# EasyEDA Pro project Arsatech-Vital-Tracker-PCB.epro

# Schematic Schematic1
Board Name: Board1; Create Date: 2025-01-30; Page Name: P1; Project Name: KPFIX; Schematic Name: Schematic1; Update Date: 2025-01-30; Company: EasyEDA.com; Page Size: A4; Version: V1.0
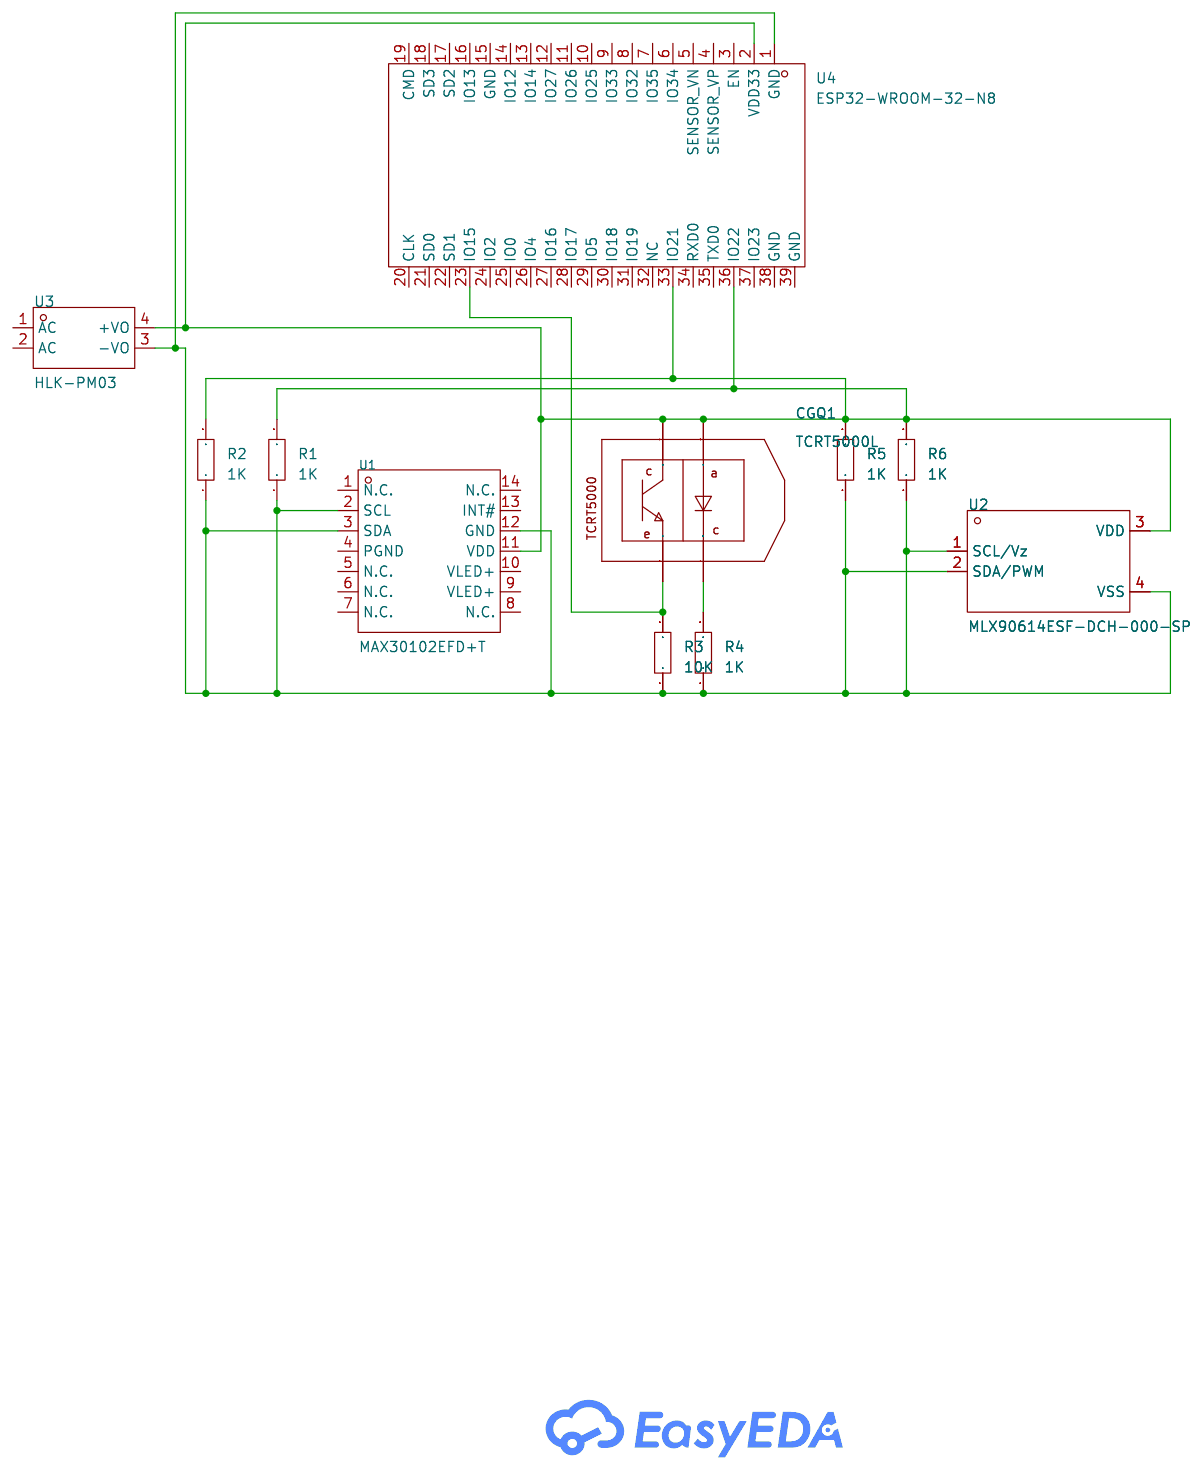
[diagram p0: schematic sheet]

## Parts
CGQ1  TCRT5000L  [OPTO-TH_TCRT5000L]
R1  1K  [R0603]
R2  1K  [R0603]
R3  10K  [R0603]
R4  1K  [R0603]
R5  1K  [R0603]
R6  1K  [R0603]
U1  MAX30102EFD+T  [OESIP-14_L5.6-W3.3-P0.80-TL]
U2  MLX90614ESF-DCH-000-SP  [TO-39-4_MELEXIS_MLX90614XXA]
U3  HLK-PM03  [PWRM-TH_HLK-PM03]
U4  ESP32-WROOM-32-N8  [WIFIM-SMD_39P-L25.5-W18.0-P1.27]

## Library data of the parts
CGQ1 = TCRT5000L: Supplier Part: C24085; Manufacturer: VISHAY(威世); Supplier Footprint: 插件; JLCPCB Part Class: Extended Part; Datasheet: https://atta.szlcsc.com/upload/public/pdf/source/20150821/1457707346389.pdf; Supplier: LCSC
R1-R6 = Res_0603: Supplier Footprint: 0603
U1 = MAX30102EFD+T_C6454833: Operating Temperature:-40℃~+85℃ Operating Temperature:-40℃~+85℃; Supplier Part: C6454833; Manufacturer: ADI(亚德诺)/MAXIM(美信); Supplier Footprint: OESIP-14; JLCPCB Part Class: Extended Part; Datasheet: https://atta.szlcsc.com/upload/public/pdf/source/20230523/5357A0E2EBB238F1082B332F3131EA1A.pdf; Supplier: LCSC; Operating Temperature: -40℃~+85℃
U2 = MLX90614ESF-DCH-000-SP: Resolution:- Resolution:- Supply Voltage:2.6V~3.6V Supply Voltage:2.6V~3.6V; Supplier Part: C17185303; Manufacturer: Melexis(比利时迈来芯); Supplier Footprint: TO-39; JLCPCB Part Class: Extended Part; Datasheet: https://atta.szlcsc.com/upload/public/pdf/source/231023/C17192539-0c521c61c9b67c34f193697436f9a827.pdf; Supplier: LCSC; Supply Voltage: 2.6V~3.6V
U3 = HLK-PM03: Conversion Type:AC-DC Input Voltage(DC):120V~350V Input Voltage(DC):120V~350V Output Voltage:3.3V Output Voltage:3.3V Output Power:3W Input Voltage(AC):90VAC~265VAC Input Voltage(AC):90VAC~265VAC Output Current (Max):1A Output Current (Max):1A Function:St; Supplier Part: C209904; Manufacturer: HI-LINK(海凌科); Supplier Footprint: 插件; JLCPCB Part Class: Extended Part; Datasheet: https://atta.szlcsc.com/upload/public/pdf/source/20231009/A2CB2EF6B3F7CFD4452AD83E39216571.pdf; Supplier: LCSC; Conversion Type: AC-DC; Input Voltage(DC): 120V~350V; Output Voltage: 3.3V; Output Power: 3W; Input Voltage(AC): 90VAC~265VAC; Output Current (Max): 1A; Function: Step-down type; Output Channel: 1; Insulated Voltage: 3kV@AC; Conversion Efficiency: 72%; Feature: Overcurrent Protection；Short-Circuit Protection
U4 = ESP32-WROOM-32-N8: LCSC Part Name: ESP32-WROOM-32-N8 停产; Supplier Part: C529582; Manufacturer: ESPRESSIF(乐鑫); Supplier Footprint: SMD,18x25.5mm; JLCPCB Part Class: Extended Part; Datasheet: https://atta.szlcsc.com/upload/public/pdf/source/20241030/CCB539BBE3BF966BF47741EF6F78A315.pdf; Supplier: LCSC

## Nets
$1N1083: CGQ1.4(C) R4.2
Net-(CGQ1-1): CGQ1.1(C) CGQ1.3(A) R1.2 R2.2 R5.2 R6.2 U1.11(VDD) U2.3(VDD) U3.4(+VO) U4.2(VDD33) U4.33(IO21) U4.36(IO22)
Net-(CGQ1-2): CGQ1.2(E) R3.2 U4.23(IO15)
Net-(R1-1): R1.1 R2.1 R3.1 R4.1 R5.1 R6.1 U1.2(SCL) U1.3(SDA) U1.12(GND) U2.1(SCL/Vz) U2.2(SDA/PWM) U2.4(VSS) U3.3(-VO) U4.1(GND)

Not connected (* = marked no-connect by the designer): U1 1(N.C.) 4(PGND) 5(N.C.) 6(N.C.) 7(N.C.) 8(N.C.) 9(VLED+) 10(VLED+) 13(INT#) 14(N.C.); U3 1(AC) 2(AC); U4 3(EN) 4(SENSOR_VP) 5(SENSOR_VN) 6(IO34) 7(IO35) 8(IO32) 9(IO33) 10(IO25) 11(IO26) 12(IO27) 13(IO14) 14(IO12) 15(GND) 16(IO13) 17(SD2) 18(SD3) 19(CMD) 20(CLK) 21(SD0) 22(SD1) 24(IO2) 25(IO0) 26(IO4) 27(IO16) 28(IO17) 29(IO5) 30(IO18) 31(IO19) 32(NC) 34(RXD0) 35(TXD0) 37(IO23) 38(GND) 39(GND)

# Board PCB1
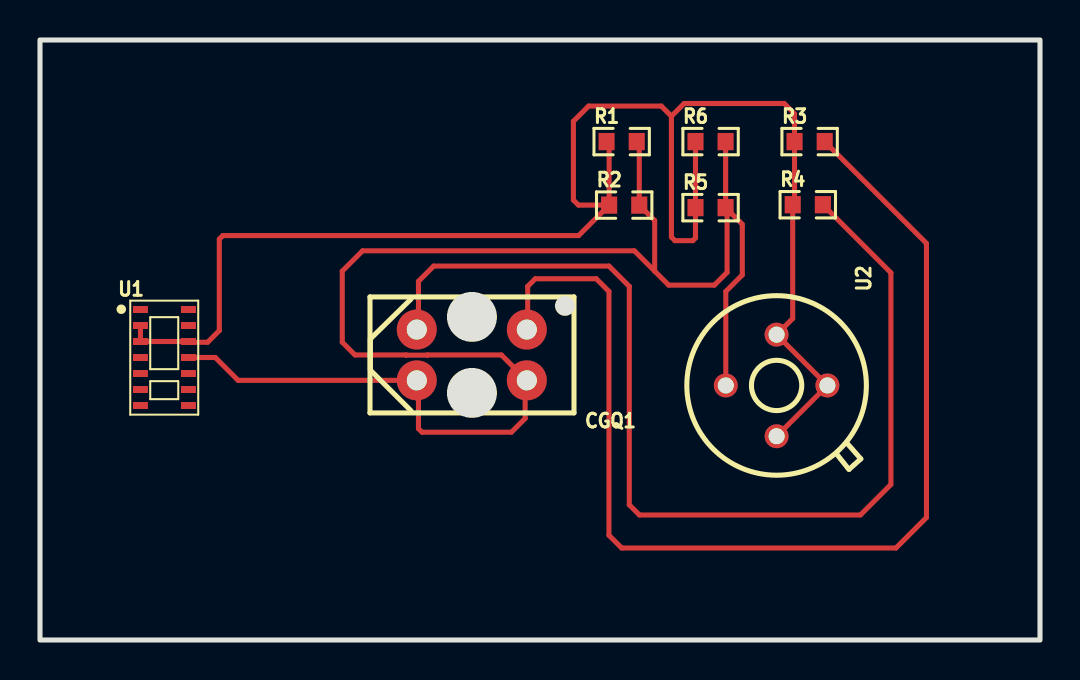
[diagram p1: board, top side]
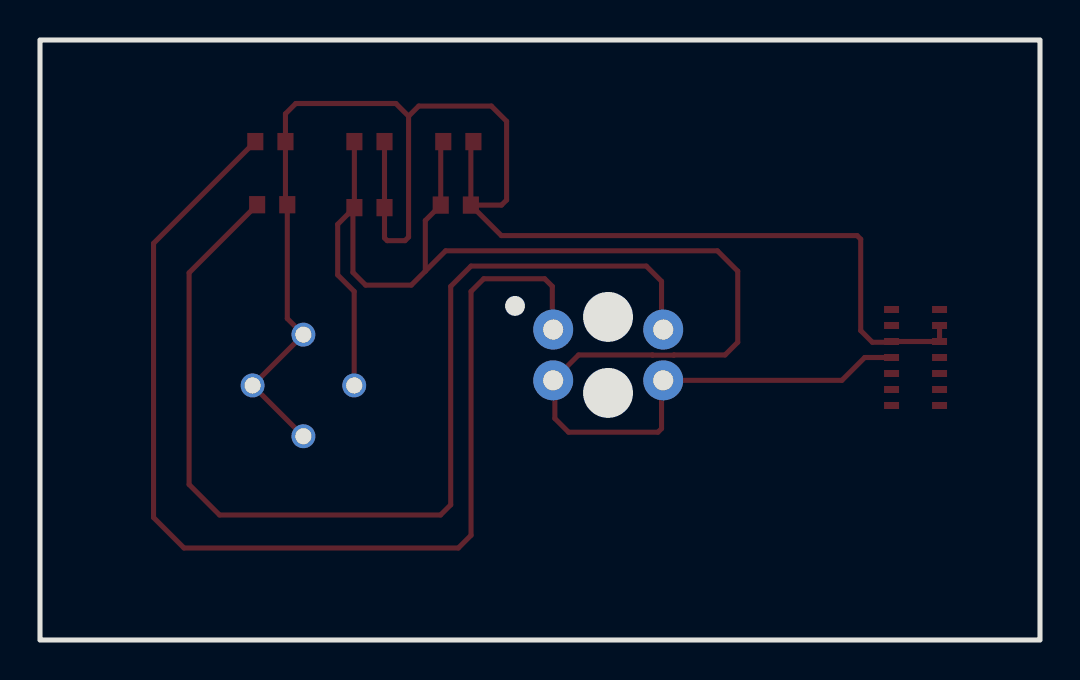
[diagram p2: board, bottom side, seen from below]

Outline 50 x 30 mm; copper layers: Top Layer, Bottom Layer. Coordinates in mm from the lower left corner of the outline.
Outline path: rectangle 0,30 50,0
Stack: Top Layer 0.035mm / Dielectric1 1.51mm FR4 er 4.5 / Bottom Layer 0.035mm

## Design rules (mm)
template: JLCPCB Capability(Two Layers Board)
spacing copperThickness1oz (default): track to track 0.102, other pairs 0.152 to 0.3
spacing copperThickness2oz: track to track 0.203, other pairs 0.152 to 0.3
track width copperThickness1oz (default): min 0.127, default 0.254, max 2.54
track width copperThickness2oz: min 0.203, default 0.254, max 2.54
differential pair differentialPair (default): width min 0.127, default 0.254, max 2.54; gap min 0.152, default 0.152
via viaSize (default): diameter min 0.5, default 0.61, max 10; hole min 0.3, default 0.305, max 6.3

## Placement (name value [footprint] x y rotation side)
CGQ1  TCRT5000L  [OPTO-TH_TCRT5000L]  21.59 14.25 180 top
R1  1K  [R0603]  29.08 24.92 0 top
R2  1K  [R0603]  29.21 21.75 0 top
R3  10K  [R0603]  38.48 24.92 0 top
R4  1K  [R0603]  38.39 21.76 0 top
R5  1K  [R0603]  33.53 21.62 0 top
R6  1K  [R0603]  33.53 24.92 0 top
U1  MAX30102EFD+T  [OESIP-14_L5.6-W3.3-P0.80-TL]  6.22 14.12 0 top
U2  MLX90614ESF-DCH-000-SP  [TO-39-4_MELEXIS_MLX90614XXA]  36.83 12.73 270 top

## Footprints (pads in the part's own frame, mm; a bottom-side part is the same pattern mirrored in y, then rotated)
OESIP-14_L5.6-W3.3-P0.80-TL
  rect 0.75x0.35 smd: 1(-1.2,2.4) 2(-1.2,1.6) 3(-1.2,0.8) 4(-1.2,0) 5(-1.2,-0.8) 6(-1.2,-1.6) 7(-1.2,-2.4) 8(1.2,-2.4) 9(1.2,-1.6) 10(1.2,-0.8) 11(1.2,0) 12(1.2,0.8) 13(1.2,1.6) 14(1.2,2.4)
OPTO-TH_TCRT5000L
  round 2 hole 1: 1(-2.751,1.27) 2(-2.751,-1.27) 3(2.751,1.27) 4(2.751,-1.27)
R0603
  rect 0.806x0.864 smd: 1(-0.753,0) 2(0.753,0)
TO-39-4_MELEXIS_MLX90614XXA
  round 1.2 hole 0.8: 1(0,2.54) 2(-2.54,0) 3(0,-2.54) 4(2.54,0)

## Nets
$1N1081: CGQ1.2 R3.2
$1N1083: CGQ1.4 R4.2
$1N1107: CGQ1.1 CGQ1.3 R1.2 R2.2 R5.2 R6.2 U1.11 U2.3
$1N1129: R1.1 R2.1 R3.1 R4.1 R5.1 R6.1 U1.2 U1.3 U1.12 U2.1 U2.2 U2.4

Pads without a net: U1 1 4 5 6 7 8 9 10 13 14

## Routing (per net, layer and track width the routed paths; a pad name or vN(x,y) marks a point on that pad's centre or on a via; arc(x,y) is an arc through that point)
$1N1081: length 56.5
  Top Layer w0.254: CGQ1.2 24.38,15.57 24.38,17.68 24.77,18.06 27.81,18.06 28.45,17.43 28.45,5.23 29.08,4.6 42.8,4.6 44.32,6.12 44.32,19.83 R3.2
$1N1083: length 54
  Top Layer w0.254: R4.2 42.55,18.36 42.55,7.78 41.02,6.25 29.97,6.25 29.46,6.76 29.46,17.68 28.45,18.7 19.68,18.7 18.92,17.94 18.92,15.61 CGQ1.4
$1N1107: length 79.1
  Top Layer w0.254: 34.35,21.55 34.35,18.38 33.72,17.74 31.43,17.74 30.73,18.44 ; 34.35,21.55 35.12,20.78 35.12,18.25 34.29,17.43 U2.3 ; 34.35,21.55 R5.2 R6.2 ; R1.2 29.96,24.79 R2.2 30.73,20.97 30.73,18.44 ; 30.73,18.44 29.72,19.46 16.13,19.46 15.11,18.44 15.11,14.89 15.75,14.25 18.3,14.25 18.31,14.24 19.37,14.24 19.38,14.25 23.07,14.25 CGQ1.1 24.26,12.9 24.26,11.08 23.57,10.39 19.1,10.39 18.92,10.57 18.92,12.9 CGQ1.3 9.91,12.98 8.76,14.12 U1.11
$1N1129: length 81.7
  Top Layer w0.254: U1.2 U1.3 U1.12 7.46,14.89 8.38,14.89 8.96,15.47 8.96,20.04 9.14,20.22 26.93,20.22 R2.1 ; R1.1 28.46,24.79 R2.1 ; R2.1 26.92,21.75 26.67,22 26.67,25.94 27.43,26.7 31.06,26.7 31.57,26.19 ; U2.4 U2.1 36.83,15.27 37.64,16.07 R4.1 37.73,21.86 R3.1 37.73,26.31 37.21,26.83 32.21,26.83 31.57,26.19 ; 31.57,26.19 31.57,20.15 31.75,19.97 32.64,19.97 32.77,20.1 R5.1 R6.1
